# EasyEDA Pro project 2024210097_冯汉禹(2).epro

# Schematic Schematic1
Board Name: Board1; Create Date: 2025-05-18; Page Name: P1; Project Name: 机器狗; Schematic Name: Schematic1; Update Date: 2025-05-18; Company: 嘉立创EDA; Page Size: A4; Version: V1.0
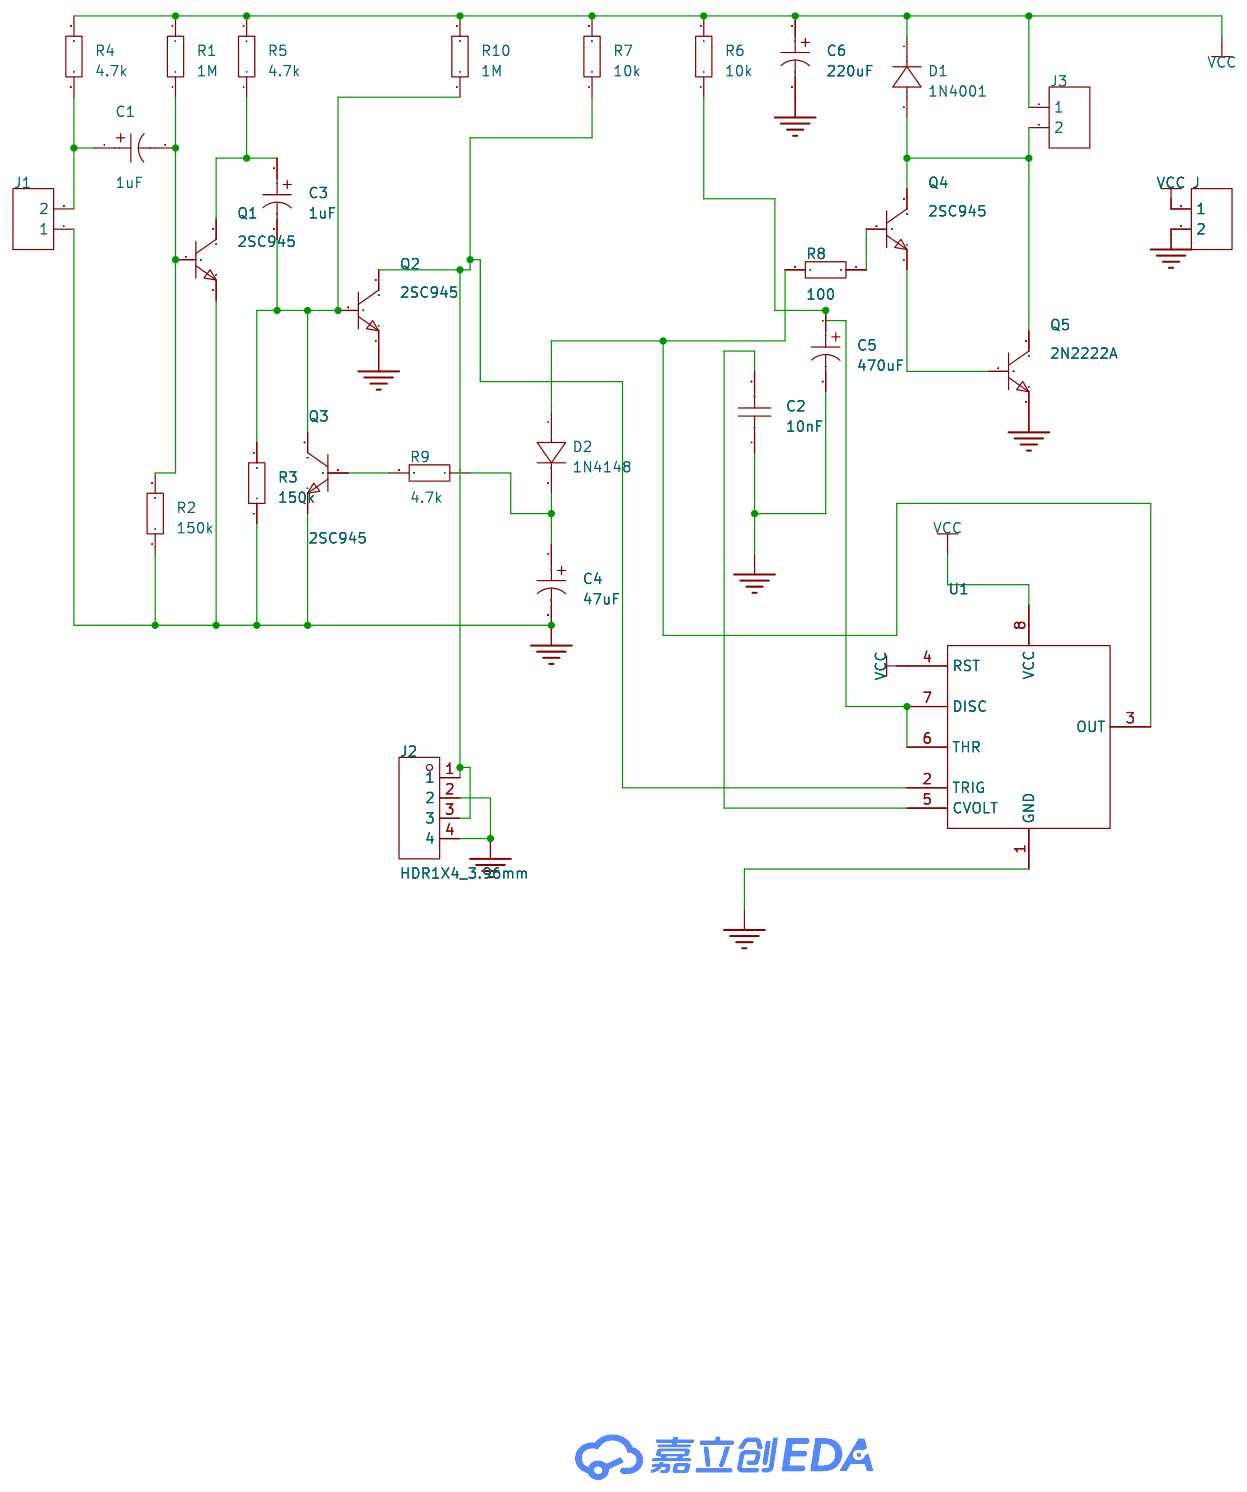
[diagram p0: schematic sheet]

## Parts
C1  1uF  [CAP-TH_BD8.2-P5.00-D0.6-FD]
C2  10nF  [CAP-TH_L9.0-W4.0-P5.00-D0.5]
C3  1uF  [CAP-TH_BD8.2-P5.00-D0.6-FD]
C4  47uF  [CAP-TH_BD10.5-P5.00-D0.6-FD]
C5  470uF  [CAP-TH_BD10.5-P5.00-D0.6-FD]
C6  220uF  [CAP-TH_BD10.5-P5.00-D0.6-FD]
D1  1N4001  [DIO-TH_BD2.5-L5.2-P9.20-D0.6-RD]
D2  1N4148  [DIO-TH_BD2.5-L5.2-P9.20-D0.6-RD]
J  -  [HDR-TH_2P-P5.08-V-M]
J1  -  [HDR-TH_2P-P5.08-V-M]
J2  HDR1X4_3.96mm  [HDR-TH_4P-P5.08-V-M]
J3  -  [HDR-TH_2P-P5.08-V-M]
Q1  2SC945  [TO-92-3_L4.9-W3.7-P1.27-L]
Q2  2SC945  [TO-92-3_L4.9-W3.7-P1.27-L]
Q3  2SC945  [TO-92-3_L4.9-W3.7-P1.27-L]
Q4  2SC945  [TO-92-3_L4.9-W3.7-P1.27-L]
Q5  2N2222A  [TO-92-3_L4.9-W3.7-P1.27-L]
R1  1M  [RES-TH_BD2.3-L6.5-P10.50-D0.5]
R2  150k  [RES-TH_BD2.3-L6.5-P10.50-D0.5]
R3  150k  [RES-TH_BD2.3-L6.5-P10.50-D0.5]
R4  4.7k  [RES-TH_BD2.3-L6.5-P10.50-D0.5]
R5  4.7k  [RES-TH_BD2.3-L6.5-P10.50-D0.5]
R6  10k  [RES-TH_BD2.3-L6.5-P10.50-D0.5]
R7  10k  [RES-TH_BD2.3-L6.5-P10.50-D0.5]
R8  100  [RES-TH_BD2.3-L6.5-P10.50-D0.5]
R9  4.7k  [RES-TH_BD2.3-L6.5-P10.50-D0.5]
R10  1M  [RES-TH_BD2.3-L6.5-P10.50-D0.5]
U1  -  [555]

## Library data of the parts
C1 C3 = UVR2E010MED: 容值:1uF;精度:±20%;额定电压:-;纹波电流:-;等效串联电阻:-;; LCSC Part Name: 1uF ±20% 停产 停产; Supplier Part: C445150; Manufacturer: Nichicon(尼吉康); Supplier Footprint: 插件,D6.3xL11mm; JLCPCB Part Class: 扩展库; Datasheet: https://atta.szlcsc.com/upload/public/pdf/source/20191118/C445215_2FA943EFC8385756780029ECA9D5B657.pdf; Supplier: LCSC; Tolerance: ±20%
C2 = 10nF: Supplier Part: C9900088240; Supplier Footprint: C1206; JLCPCB Part Class: 扩展库; Supplier: LCSC
C4 = CD26G1JM470E120T: 容值:47uF;精度:±20%;额定电压:63V;纹波电流:-;等效串联电阻(ESR):-;; LCSC Part Name: 47uF ±20% 63V; Supplier Part: C46472512; Manufacturer: 创慧电子; Supplier Footprint: 插件,D6.3xL12mm; Datasheet: https://atta.szlcsc.com/upload/public/pdf/source/20250208/95E25F66E0D5629BBC6A4318C6E986E6.pdf; Supplier: LCSC; Tolerance: ±20%; Voltage Rating: 63V; Pin Spacing: 2.5mm; Diameter: 6.3mm; Height - Seated (Max): 12mm; Lifetime: 8000hrs@105℃; Operating Temperature: -40℃~+105℃
C5 = ERR1EM471F12P50: 容值:470uF;精度:±20%;额定电压:25V;纹波电流:-;等效串联电阻:-;; LCSC Part Name: 470uF ±20% 25V; Supplier Part: C401511; Manufacturer: AISHI(艾华集团); Supplier Footprint: 插件,D8xL12mm; JLCPCB Part Class: 扩展库; Datasheet: https://atta.szlcsc.com/upload/public/pdf/source/20190702/C401591_1676EF45BC9A88BD1D6B22BBAE3913C7.pdf; Supplier: LCSC; Tolerance: ±20%; Rated Voltage: 25V; Lead Spacing: 5mm; φD: 8mm; L: 12mm; Lifetime @ Temp: 2000hrs@105℃
C6 = UKA1E221MPD1TD: 容值:220uF;精度:±20%;额定电压:25V;纹波电流:360mA@10kHz;等效串联电阻(ESR):-;; LCSC Part Name: 220uF ±20% 25V; Supplier Part: C1588801; Manufacturer: Nichicon(尼吉康); Supplier Footprint: 插件; JLCPCB Part Class: 扩展库; Datasheet: https://atta.szlcsc.com/upload/public/pdf/source/20220505/028EE900D47FF09CA318770E736AF0EB.pdf; Supplier: LCSC; Tolerance: ±20%; Voltage Rating: 25V; Ripple Current: 360mA@10kHz; Pin Spacing: 3.5mm; Diameter: 8mm; Lifetime: 2000hrs@105℃; Operating Temperature: -55℃~+105℃
D1 = 1N4001: Supplier Part: C9900008134; Supplier Footprint: SMA_L4.3-W2.6-LS5.1-RD; JLCPCB Part Class: 扩展库; Supplier: LCSC
D2 = 1N4148_C18195411: Supplier Part: C18195411; Manufacturer: LJ(朗捷); Supplier Footprint: DO-35; JLCPCB Part Class: 扩展库; Datasheet: https://atta.szlcsc.com/upload/public/pdf/source/20230921/E18EF32AEA6D96127C0687F4453A915D.pdf; Supplier: LCSC
J J1 J3 = HDR-F_2.54_1x2P: Supplier Part: C49661; Supplier Footprint: 插件
J2 = HDR1X4_3.96mm: Supplier Part: C9900002236; Supplier Footprint: TH-4_8.2X15.84X3.96P; JLCPCB Part Class: 扩展库; Supplier: LCSC
Q1-Q4 = 2SC945: LCSC Part Name: 三极管 停产; Supplier Part: C2987754; Manufacturer: ST(先科); Supplier Footprint: TO-92-3; JLCPCB Part Class: 扩展库; Datasheet: https://atta.szlcsc.com/upload/public/pdf/source/20220401/866B6C811E060AF67E1650FE9BEED438.pdf; Supplier: LCSC
Q5 = 2N2222A: 晶体管类型:NPN;集电极电流(Ic):600mA;集射极击穿电压(Vceo):40V;功率(Pd):625mW;直流电流增益(hFE@Ic,Vce):40@500mA,10V;; LCSC Part Name: NPN 电流:600mA 耐压:40V; Supplier Part: C118536; Manufacturer: ST(先科); Supplier Footprint: TO-92-3; JLCPCB Part Class: 扩展库; Datasheet: https://atta.szlcsc.com/upload/public/pdf/source/20170719/C118536_1500457734789828244.pdf; Supplier: LCSC; Transistor Type: NPN; Collector Current (Ic): 600mA; Collector-Emitter Breakdown Voltage (Vceo): 40V; Power Dissipation (Pd): 625mW; DC Current Gain (hFE@Ic,Vce): 40@500mA,10V; Transition Frequency (fT): 250MHz; Collector Cut-Off Current (Icbo): 10nA; Collector-Emitter Saturation Voltage (VCE(sat)@Ic,Ib): 1V@500mA,50mA
R1-R10 = Res_0603: Supplier Footprint: 0603
U1 = 555

## Nets
GND: C2.1 C4.2 C5.2 C6.2 J.2 J1.1 J2.2 J2.4 Q1.1(E) Q2.1(E) Q3.1(E) Q5.1(E) R2.1 R3.1 U1.1(GND)
VCC: C6.1 D1.1(K) J.1 J3.1 R1.2 R4.2 R5.2 R6.2 R7.2 R10.2 U1.4(RST) U1.8(VCC)
$1N535: D1.2(A) J3.2 Q4.2(C) Q5.3(C)
$1N752: Q4.1(E) Q5.2(B)
$1N1142: C2.2 U1.5(CVOLT)
$1N1203: C5.1 R6.1 U1.6(THR) U1.7(DISC)
$1N1422: D2.1(A) R8.2 U1.3(OUT)
$1N1429: Q4.3(B) R8.1
$1N1586: C4.1 D2.2(C) R9.1
$1N1621: J2.1 J2.3 Q2.2(C) R7.1 U1.2(TRIG)
$1N2115: C3.2 Q2.3(B) Q3.2(C) R3.2 R10.1
$1N2177: Q3.3(B) R9.2
$1N2293: C3.1 Q1.2(C) R5.1
$1N2442: C1.2 Q1.3(B) R1.1 R2.2
$1N2488: C1.1 J1.2 R4.1

# Board PCB1
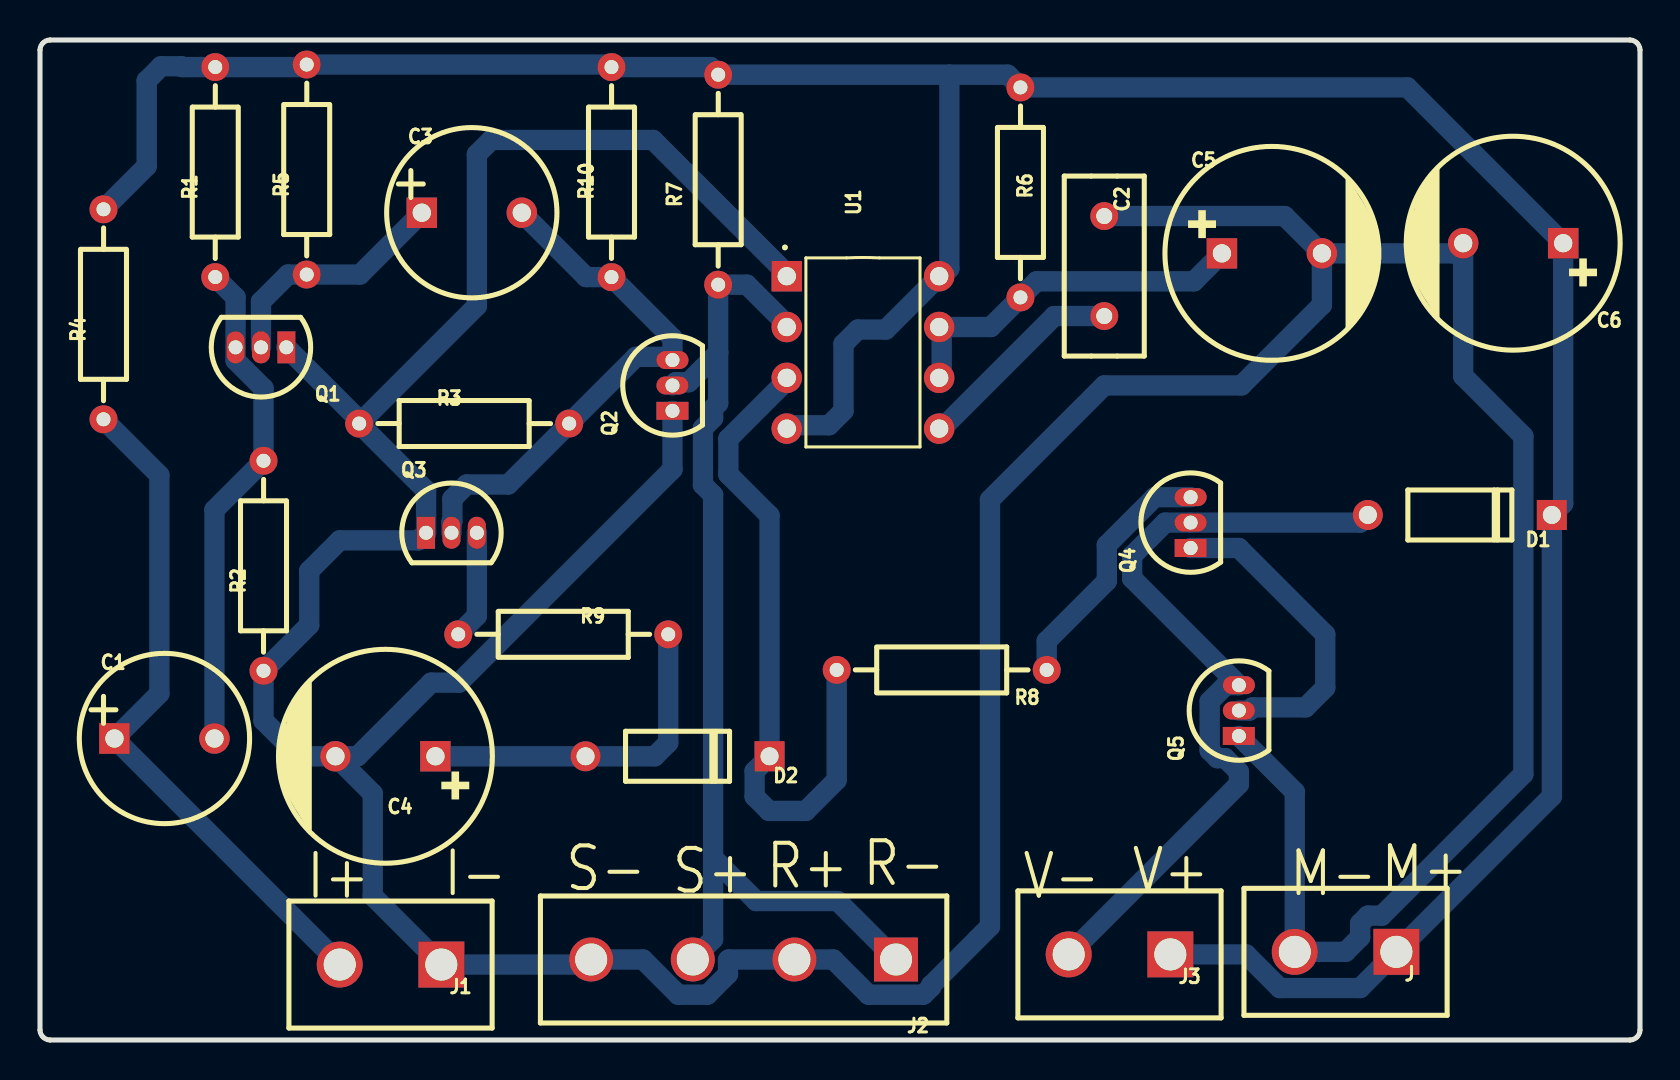
[diagram p1: board, top side]
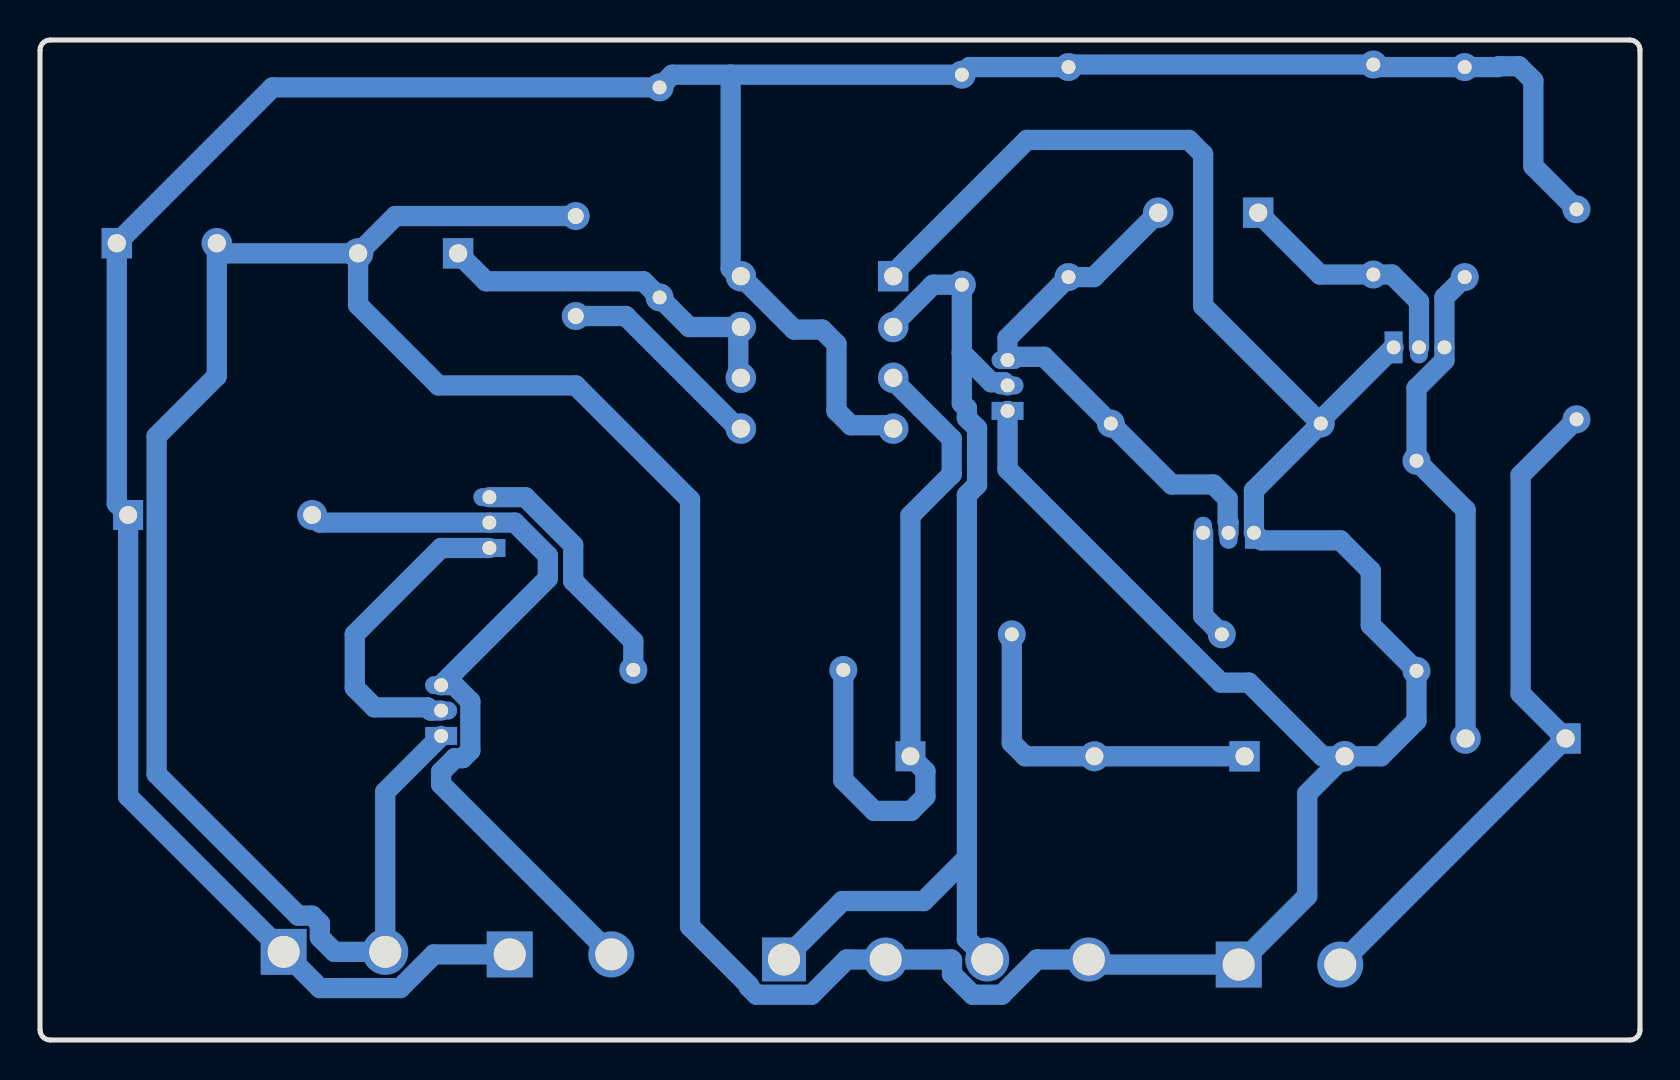
[diagram p2: board, bottom side, seen from below]

Outline 80 x 50 mm; copper layers: Top Layer, Bottom Layer. Coordinates in mm from the lower left corner of the outline.
Outline path: 0,49.49 0,0.51 arc(0.15,0.15) 0.51,0 79.49,0 arc(79.85,0.15) 80,0.51 80,49.49 arc(79.85,49.85) 79.49,50 0.51,50 arc(0.15,49.85) 0,49.49
Stack: Top Layer 0.035mm / Dielectric1 1.51mm FR4 er 4.5 / Bottom Layer 0.035mm

## Design rules (mm)
template: 自定义配置
spacing copperThickness1oz (default): track to track 0.254, other pairs 0.152 to 0.3
spacing copperThickness2oz: track to track 0.203, other pairs 0.152 to 0.3
track width copperThickness1oz (default): min 1.016, default 1.016, max 2.54
track width copperThickness2oz: min 0.203, default 0.254, max 2.54
differential pair differentialPair (default): width min 0.127, default 0.254, max 2.54; gap min 0.152, default 0.152
via viaSize (default): diameter min 0.5, default 0.61, max 10; hole min 0.3, default 0.305, max 6.299

## Placement (name value [footprint] x y rotation side)
C1  1uF  [CAP-TH_BD8.2-P5.00-D0.6-FD]  6.22 15.08 0 top
C2  10nF  [CAP-TH_L9.0-W4.0-P5.00-D0.5]  53.21 38.7 270 top
C3  1uF  [CAP-TH_BD8.2-P5.00-D0.6-FD]  21.59 41.36 0 top
C4  47uF  [CAP-TH_BD10.5-P5.00-D0.6-FD]  17.27 14.19 180 top
C5  470uF  [CAP-TH_BD10.5-P5.00-D0.6-FD]  61.59 39.33 0 top
C6  220uF  [CAP-TH_BD10.5-P5.00-D0.6-FD]  73.66 39.84 180 top
D1  1N4001  [DIO-TH_BD2.5-L5.2-P9.20-D0.6-RD]  70.99 26.25 180 top
D2  1N4148  [DIO-TH_BD2.5-L5.2-P9.20-D0.6-RD]  31.88 14.19 180 top
J  -  [HDR-TH_2P-P5.08-V-M]  65.28 4.41 180 top
J1  -  [HDR-TH_2P-P5.08-V-M]  17.53 3.77 180 top
J2  HDR1X4_3.96mm  [HDR-TH_4P-P5.08-V-M]  35.18 4.03 180 top
J3  -  [HDR-TH_2P-P5.08-V-M]  53.97 4.28 180 top
Q1  2SC945  [TO-92-3_L4.9-W3.7-P1.27-L]  11.05 34.63 180 top
Q2  2SC945  [TO-92-3_L4.9-W3.7-P1.27-L]  31.62 32.73 90 top
Q3  2SC945  [TO-92-3_L4.9-W3.7-P1.27-L]  20.57 25.36 0 top
Q4  2SC945  [TO-92-3_L4.9-W3.7-P1.27-L]  57.53 25.87 90 top
Q5  2N2222A  [TO-92-3_L4.9-W3.7-P1.27-L]  59.94 16.47 90 top
R1  1M  [RES-TH_BD2.3-L6.5-P10.50-D0.5]  8.76 43.4 90 top
R2  150k  [RES-TH_BD2.3-L6.5-P10.50-D0.5]  11.18 23.71 90 top
R3  150k  [RES-TH_BD2.3-L6.5-P10.50-D0.5]  21.21 30.82 0 top
R4  4.7k  [RES-TH_BD2.3-L6.5-P10.50-D0.5]  3.17 36.28 90 top
R5  4.7k  [RES-TH_BD2.3-L6.5-P10.50-D0.5]  13.33 43.52 90 top
R6  10k  [RES-TH_BD2.3-L6.5-P10.50-D0.5]  49.02 42.38 90 top
R7  10k  [RES-TH_BD2.3-L6.5-P10.50-D0.5]  33.91 43.02 90 top
R8  100  [RES-TH_BD2.3-L6.5-P10.50-D0.5]  45.09 18.5 180 top
R9  4.7k  [RES-TH_BD2.3-L6.5-P10.50-D0.5]  26.16 20.28 180 top
R10  1M  [RES-TH_BD2.3-L6.5-P10.50-D0.5]  28.57 43.4 90 top
U1  -  [555]  37.34 38.19 270 top

## Footprints (pads in the part's own frame, mm; a bottom-side part is the same pattern mirrored in y, then rotated)
555
  rect 1.524x1.524 hole 0.914: 1(0,0)
  round 1.524 hole 0.914: 2(2.54,0) 3(5.08,0) 4(7.62,0) 5(7.62,7.62) 6(5.08,7.62) 7(2.54,7.62) 8(0,7.62)
CAP-TH_BD8.2-P5.00-D0.6-FD
  rect 1.524x1.524 hole 0.914: 1(-2.5,0)
  round 1.524 hole 0.914: 2(2.5,0)
CAP-TH_BD10.5-P5.00-D0.6-FD
  rect 1.524x1.524 hole 0.914: 1(-2.5,0)
  round 1.524 hole 0.914: 2(2.5,0)
CAP-TH_L9.0-W4.0-P5.00-D0.5
  round 1.4 hole 0.8: 1(-2.5,0) 2(2.5,0)
DIO-TH_BD2.5-L5.2-P9.20-D0.6-RD
  rect 1.5x1.5 hole 0.9: 1(-4.6,0)
  round 1.5 hole 0.9: 2(4.6,0)
HDR-TH_2P-P5.08-V-M
  rect 2.3x2.3 hole 1.6: 1(-2.54,0)
  round 2.3 hole 1.6: 2(2.54,0)
HDR-TH_4P-P5.08-V-M
  rect 2.2x2.2 hole 1.6: 1(-7.62,0)
  round 2.2 hole 1.6: 2(-2.54,0) 3(2.54,0) 4(7.62,0)
RES-TH_BD2.3-L6.5-P10.50-D0.5
  round 1.4 hole 0.7: 1(-5.25,0) 2(5.25,0)
TO-92-3_L4.9-W3.7-P1.27-L
  rect 0.9x1.6 hole 0.7: 1(-1.27,0)
  oval 0.9x1.6 hole 0.7: 2(0,0) 3(1.27,0)

## Nets
As in the schematic.

## Routing (per net, layer and track width the routed paths; a pad name or vN(x,y) marks a point on that pad's centre or on a via; arc(x,y) is an arc through that point)
GND: length 254.9
  Bottom Layer w1.016: C5.2 64.09,36.75 60.07,32.73 53.21,32.73 47.5,27.01 47.5,5.68 44.56,2.74 44.56,2.65 44.17,2.27 41.43,2.27 39.66,4.03 J2.2 34.44,4.03 34.4,3.99 34.4,3.3 33.37,2.27 31.91,2.27 30.15,4.03 J2.4 27.31,3.77 J1.1 16.64,7.2 16.64,12.32 C4.2 ; C5.2 62.23,41.2 C2.1 ; C5.2 70.65,39.33 C6.2 71.16,33.2 74.17,30.19 74.17,13.3 67.09,6.22 66.39,6.22 66.01,5.83 66.01,5.14 65.28,4.41 J.2 62.74,12.41 Q5.1 ; R3.1 21.84,36.71 21.84,44.28 22.56,45 30.65,45 37.47,38.19 ; R3.1 19.3,27.48 Q3.1 18.92,24.98 14.99,24.98 13.46,23.46 13.46,20.75 R2.1 11.18,15.96 12.95,14.19 C4.2 ; R3.1 15.96,30.99 Q1.1 ; C4.2 15.88,14.19 19.56,17.87 20.96,17.87 31.62,28.54 Q2.1
VCC: length 156.8
  Bottom Layer w1.016: R4.2 5.33,43.69 5.33,47.97 6.05,48.69 7.07,48.69 7.11,48.65 R1.2 13.21,48.65 R5.2 28.45,48.77 R10.2 33.53,48.65 R7.2 45.47,48.27 ; U1.4 37.51,30.74 39.46,30.74 40.18,31.46 40.18,34.8 40.89,35.52 42.29,35.52 U1.8 ; 45.47,48.27 45.47,38.57 45.09,38.19 ; 45.47,48.27 48.39,48.27 R6.2 68.37,47.63 C6.1 76.16,26.82 D1.1 75.59,12.18 J.1 66.01,2.6 61.99,2.6 60.3,4.28 J3.1
$1N535: length 40.1
  Bottom Layer w1.016: J3.2 59.94,12.79 59.94,13.41 59.26,14.09 58.87,14.09 58.48,14.48 58.48,16.93 59.29,17.74 Q5.3 54.61,23.08 54.61,24.22 56.26,25.87 Q4.2 66.01,25.87 D1.2
$1N752: length 16
  Bottom Layer w1.016: Q4.1 59.94,24.6 64.26,20.28 64.26,17.61 63.28,16.63 60.63,16.63 60.47,16.47 Q5.2
$1N1142: length 10.5
  Bottom Layer w1.016: C2.2 50.71,36.2 45.09,30.57
$1N1203: length 18.1
  Bottom Layer w1.016: 45.09,33.11 45.09,35.65 47.54,35.65 R6.1 49.83,37.94 57.7,37.94 C5.1
$1N1422: length 33.9
  Bottom Layer w1.016: R8.2 39.84,13 38.29,11.46 36.45,11.46 35.73,12.17 35.73,13.44 D2.1 36.48,26.22 34.42,28.28 34.42,30.06 37.47,33.11
$1N1429: length 12.7
  Bottom Layer w1.016: Q4.3 55.74,27.14 53.34,24.75 53.34,22.95 50.34,19.94 R8.1
$1N1586: length 17.3
  Bottom Layer w1.016: C4.1 30.73,14.19 31.41,14.86 R9.1
$1N1621: length 53.3
  Bottom Layer w1.016: 33.66,9.11 33.66,5.04 J2.3 ; 33.66,9.11 33.66,27.25 33.15,27.76 33.15,30.59 33.66,31.09 33.66,31.58 33.91,31.84 33.91,34.36 ; 33.66,9.11 35.81,6.95 39.88,6.95 J2.1 ; 37.47,35.65 35.35,37.77 R7.1 33.91,34.36 ; Q2.2 31.78,32.89 32.43,32.89 33.91,34.36
$1N2115: length 26.7
  Bottom Layer w1.016: C3.2 27.31,38.15 R10.1 31.62,35.1 31.62,34.16 29.79,34.16 R3.2 23.41,27.78 21.34,27.78 20.62,27.06 20.62,25.93 20.57,25.89 Q3.2
$1N2177: length 5.5
  Bottom Layer w1.016: Q3.3 21.84,21.21 R9.2
$1N2293: length 12.2
  Bottom Layer w1.016: C3.1 16,38.27 R5.1 12.4,38.27 11.05,36.92 Q1.2
$1N2442: length 25.1
  Bottom Layer w1.016: R1.1 9.78,37.13 Q1.3 9.78,33.98 11.18,32.59 R2.2 8.72,26.51 C1.2
$1N2488: length 34
  Bottom Layer w1.016: J1.2 14.99,3.81 C1.1 5.97,17.32 5.97,28.24 R4.1

## Text on the board
Top Silkscreen Layer: I+ | I- | S- | S+ | R+ | R- | V- | V+ | M- | M+
